# Altium project dashcam_cpu_v2.0.PrjPcb (part 13 of 13)
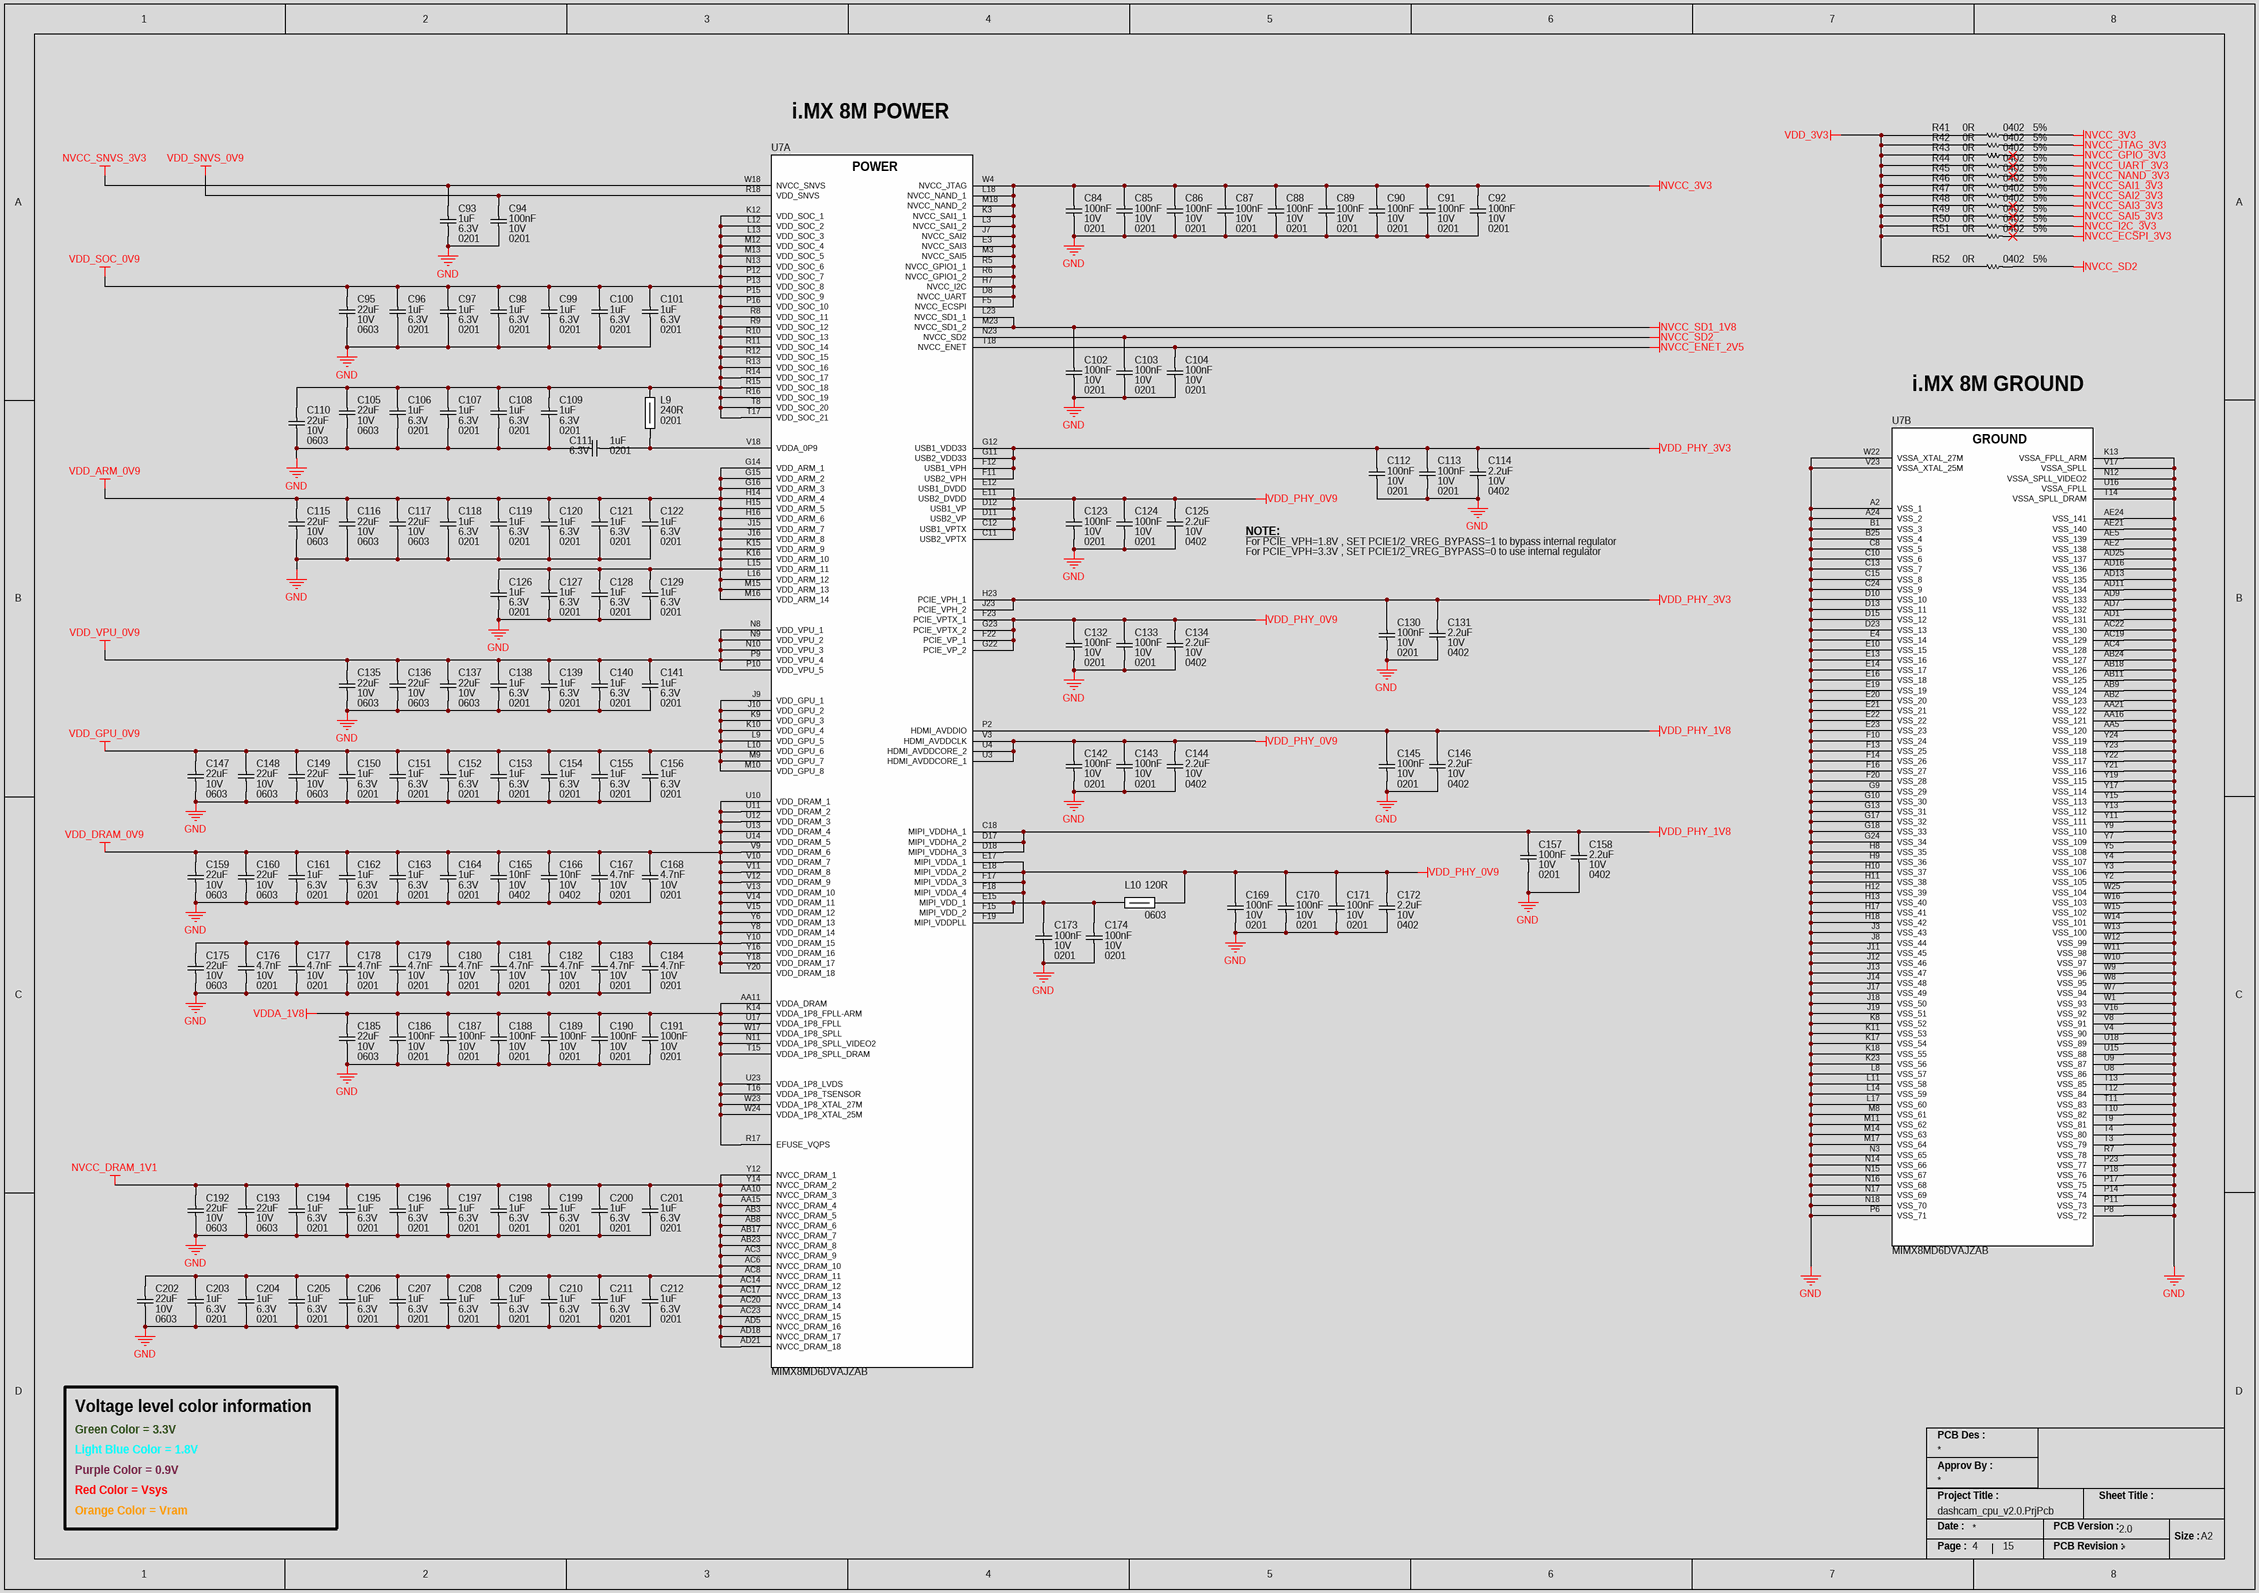
[diagram p116: mx8m_power.SchDoc]

## Nets that join several sheets
DC_IN: mx8m_pmic (D1.A J1.1), usb_debug (TP54.1)
GND: mx8m_dram (C213.1 R53.1 R54.1), mx8m_cfg (20 pins), mx8m_io (C221.1 C222.1 C223.1 U9.6), mx8m_phy (5 pins), mx8m_pmic (108 pins), dram_lpddr4 (84 pins), emmc_flash (21 pins), usb_debug (26 pins), wifi_ble (74 pins), boot_cfg (24 pins), mx8m_power (277 pins)
NVCC_3V3: mx8m_pmic (U6.55), mx8m_power (23 pins)
NVCC_DRAM_1V1: mx8m_pmic (8 pins), dram_lpddr4 (64 pins), mx8m_power (39 pins)
NVCC_JTAG_3V3: mx8m_cfg (D6.2 R55.2 R56.2 R57.2), boot_cfg (R158.2 R164.1 U15.5), mx8m_power (R42.2)
NVCC_SAI1_3V3: boot_cfg (16 pins), mx8m_power (R46.2)
NVCC_SAI2_3V3: mx8m_io (C222.2 U9.1 U9.12), mx8m_power (R47.2)
NVCC_SD1_1V8: mx8m_pmic (R37.2), emmc_flash (12 pins), mx8m_power (C102.2 U7.L23 U7.M23)
NVCC_SNVS_3V3: mx8m_cfg (6 pins), mx8m_pmic (5 pins), boot_cfg (5 pins), mx8m_power (C93.2 U7.W18)
VBUS_USB_DBG: mx8m_phy (R86.2), usb_debug (6 pins)
VDD_1V8: mx8m_pmic (8 pins), dram_lpddr4 (14 pins)
VDD_3V3: mx8m_io (10 pins), mx8m_pmic (C14.2 Q1.3 TP4.1), emmc_flash (7 pins), usb_debug (11 pins), wifi_ble (7 pins), mx8m_power (12 pins)
VDD_ARM_0V9: mx8m_pmic (9 pins), mx8m_power (26 pins)
VDD_DRAM_0V9: mx8m_pmic (7 pins), mx8m_power (38 pins)
VDD_GPU_0V9: mx8m_pmic (7 pins), mx8m_power (18 pins)
VDD_PHY_0V9: mx8m_pmic (C72.1 TP16.1 U6.18), mx8m_power (32 pins)
VDD_PHY_1V8: mx8m_pmic (C73.1 TP17.1 U6.26), mx8m_power (8 pins)
VDD_PHY_3V3: mx8m_pmic (C77.1 TP19.1 U6.39), mx8m_power (11 pins)
VDD_SNVS_0V9: mx8m_pmic (6 pins), mx8m_power (C94.2 U7.R18)
VDD_SOC_0V9: mx8m_pmic (7 pins), mx8m_power (35 pins)
VDD_VPU_0V9: mx8m_pmic (6 pins), mx8m_power (12 pins)
VDDA_1V8: mx8m_pmic (C75.1 R9.2 TP18.1 U6.28), mx8m_power (18 pins)
BOOT_MODE0: mx8m_cfg (U7.W6), usb_debug (TP52.1), boot_cfg (R161.1 R163.2 SW3.2 U15.3)
BOOT_MODE1: mx8m_cfg (U7.V6), usb_debug (TP53.1), boot_cfg (R157.1 R159.1 SW3.1 U15.6)
BT_PCM_CLK: mx8m_io (U9.9), wifi_ble (U13.9)
BT_PCM_IN: mx8m_io (U9.8), wifi_ble (U13.11)
BT_PCM_OUT: mx8m_io (U9.10), wifi_ble (U13.10)
BT_PCM_SYNC: mx8m_io (U9.7), wifi_ble (U13.7)
BT_UART_CTS_N: mx8m_io (U7.R24), wifi_ble (U13.47)
BT_UART_RTS_N: mx8m_io (U7.T24), wifi_ble (U13.48)
BT_UART_RXD: mx8m_io (U7.T25), wifi_ble (U13.46)
BT_UART_TXD: mx8m_io (U7.R25), wifi_ble (U13.49)
CONFIG_AUTO: mx8m_io (U7.D3), wifi_ble (U13.23)
CONFIG_HOST_0: mx8m_io (U7.G4), wifi_ble (U13.12)
CONFIG_HOST_1: mx8m_io (U7.H4), wifi_ble (U13.13)
DRAM_A_DATA0: mx8m_dram (U7.AE23), dram_lpddr4 (U10.AA11)
DRAM_A_DATA1: mx8m_dram (U7.AD24), dram_lpddr4 (U10.Y11)
DRAM_A_DATA2: mx8m_dram (U7.AE22), dram_lpddr4 (U10.V11)
DRAM_A_DATA3: mx8m_dram (U7.AD22), dram_lpddr4 (U10.U11)
DRAM_A_DATA4: mx8m_dram (U7.AA24), dram_lpddr4 (U10.U9)
DRAM_A_DATA5: mx8m_dram (U7.Y25), dram_lpddr4 (U10.V9)
DRAM_A_DATA6: mx8m_dram (U7.AA25), dram_lpddr4 (U10.Y9)
DRAM_A_DATA7: mx8m_dram (U7.AB25), dram_lpddr4 (U10.AA9)
DRAM_A_DATA8: mx8m_dram (U7.AB22), dram_lpddr4 (U10.AA2)
DRAM_A_DATA9: mx8m_dram (U7.AA22), dram_lpddr4 (U10.Y2)
DRAM_A_DATA10: mx8m_dram (U7.AA23), dram_lpddr4 (U10.V2)
DRAM_A_DATA11: mx8m_dram (U7.AA20), dram_lpddr4 (U10.U2)
DRAM_A_DATA12: mx8m_dram (U7.AA18), dram_lpddr4 (U10.U4)
DRAM_A_DATA13: mx8m_dram (U7.AB19), dram_lpddr4 (U10.V4)
DRAM_A_DATA14: mx8m_dram (U7.AA19), dram_lpddr4 (U10.Y4)
DRAM_A_DATA15: mx8m_dram (U7.AA17), dram_lpddr4 (U10.AA4)
DRAM_A_DMI0: mx8m_dram (U7.AD23), dram_lpddr4 (U10.Y10)
DRAM_A_DMI1: mx8m_dram (U7.AB20), dram_lpddr4 (U10.Y3)
DRAM_A_DQS0_N: mx8m_dram (U7.AC25), dram_lpddr4 (U10.V10)
DRAM_A_DQS0_P: mx8m_dram (U7.AC24), dram_lpddr4 (U10.W10)
DRAM_A_DQS1_N: mx8m_dram (U7.AC21), dram_lpddr4 (U10.V3)
DRAM_A_DQS1_P: mx8m_dram (U7.AB21), dram_lpddr4 (U10.W3)
DRAM_B_DATA0: mx8m_dram (U7.AE3), dram_lpddr4 (U10.B2)
DRAM_B_DATA1: mx8m_dram (U7.AD2), dram_lpddr4 (U10.C2)
DRAM_B_DATA2: mx8m_dram (U7.AE4), dram_lpddr4 (U10.E2)
DRAM_B_DATA3: mx8m_dram (U7.AD4), dram_lpddr4 (U10.F2)
DRAM_B_DATA4: mx8m_dram (U7.AA2), dram_lpddr4 (U10.F4)
DRAM_B_DATA5: mx8m_dram (U7.Y1), dram_lpddr4 (U10.E4)
DRAM_B_DATA6: mx8m_dram (U7.AA1), dram_lpddr4 (U10.C4)
DRAM_B_DATA7: mx8m_dram (U7.AB1), dram_lpddr4 (U10.B4)
DRAM_B_DATA8: mx8m_dram (U7.AB4), dram_lpddr4 (U10.B11)
DRAM_B_DATA9: mx8m_dram (U7.AA4), dram_lpddr4 (U10.C11)
DRAM_B_DATA10: mx8m_dram (U7.AA3), dram_lpddr4 (U10.E11)
DRAM_B_DATA11: mx8m_dram (U7.AA6), dram_lpddr4 (U10.F11)
DRAM_B_DATA12: mx8m_dram (U7.AA8), dram_lpddr4 (U10.F9)
DRAM_B_DATA13: mx8m_dram (U7.AB7), dram_lpddr4 (U10.E9)
DRAM_B_DATA14: mx8m_dram (U7.AA7), dram_lpddr4 (U10.C9)
DRAM_B_DATA15: mx8m_dram (U7.AA9), dram_lpddr4 (U10.B9)
DRAM_B_DMI0: mx8m_dram (U7.AD3), dram_lpddr4 (U10.C3)
DRAM_B_DMI1: mx8m_dram (U7.AB6), dram_lpddr4 (U10.C10)
DRAM_B_DQS0_N: mx8m_dram (U7.AC1), dram_lpddr4 (U10.E3)
DRAM_B_DQS0_P: mx8m_dram (U7.AC2), dram_lpddr4 (U10.D3)
DRAM_B_DQS1_N: mx8m_dram (U7.AC5), dram_lpddr4 (U10.E10)
DRAM_B_DQS1_P: mx8m_dram (U7.AB5), dram_lpddr4 (U10.D10)
DRAM_CA0_A: mx8m_dram (U7.AD17), dram_lpddr4 (U10.H2)
DRAM_CA0_B: mx8m_dram (U7.AE8), dram_lpddr4 (U10.R2)
DRAM_CA1_A: mx8m_dram (U7.AE16), dram_lpddr4 (U10.J2)
DRAM_CA1_B: mx8m_dram (U7.AE9), dram_lpddr4 (U10.P2)
DRAM_CA2_A: mx8m_dram (U7.AD20), dram_lpddr4 (U10.H9)
DRAM_CA2_B: mx8m_dram (U7.AC7), dram_lpddr4 (U10.R9)
DRAM_CA3_A: mx8m_dram (U7.AE20), dram_lpddr4 (U10.H10)
DRAM_CA3_B: mx8m_dram (U7.AE7), dram_lpddr4 (U10.R10)
DRAM_CA4_A: mx8m_dram (U7.AD19), dram_lpddr4 (U10.H11)
DRAM_CA4_B: mx8m_dram (U7.AE6), dram_lpddr4 (U10.R11)
DRAM_CA5_A: mx8m_dram (U7.AE19), dram_lpddr4 (U10.J11)
DRAM_CA5_B: mx8m_dram (U7.AD6), dram_lpddr4 (U10.P11)
DRAM_CK_A_N: mx8m_dram (U7.AE14), dram_lpddr4 (R93.2 R100.2 U10.J9)
DRAM_CK_A_P: mx8m_dram (U7.AD14), dram_lpddr4 (R94.2 R100.1 U10.J8)
DRAM_CK_B_N: mx8m_dram (U7.AE12), dram_lpddr4 (R96.2 R101.2 U10.P9)
DRAM_CK_B_P: mx8m_dram (U7.AD12), dram_lpddr4 (R97.2 R101.1 U10.P8)
DRAM_CKE0_A: mx8m_dram (U7.AC16), dram_lpddr4 (U10.J4)
DRAM_CKE0_B: mx8m_dram (U7.AD10), dram_lpddr4 (U10.P4)
DRAM_CKE1_A: mx8m_dram (U7.AE17), dram_lpddr4 (U10.J5)
DRAM_CKE1_B: mx8m_dram (U7.AE10), dram_lpddr4 (U10.P5)
DRAM_nCS0_A: mx8m_dram (U7.AE18), dram_lpddr4 (U10.H4)
DRAM_nCS0_B: mx8m_dram (U7.AC9), dram_lpddr4 (U10.R4)
DRAM_nCS1_A: mx8m_dram (U7.AC18), dram_lpddr4 (U10.H3)
DRAM_nCS1_B: mx8m_dram (U7.AD8), dram_lpddr4 (U10.R3)
DRAM_nRESET: mx8m_dram (R53.2 U7.AB13), dram_lpddr4 (U10.T11)
I2C1_SCL: mx8m_io (R83.1 U7.E7), mx8m_pmic (R34.2)
I2C1_SDA: mx8m_io (R82.1 U7.E8), mx8m_pmic (R33.2)
nWDOG: mx8m_io (U7.R4), mx8m_pmic (C25.1)
ONOFF: mx8m_cfg (R64.1 TP32.1 U7.W21), usb_debug (C268.1 S1.3), boot_cfg (D15.2)
PMIC_32K_OUT: mx8m_io (U7.F6), wifi_ble (U13.42)
PMIC_nINT: mx8m_io (U7.P4), mx8m_pmic (U6.1)
PMIC_ON_REQ: mx8m_cfg (U7.V20), mx8m_pmic (R26.1 R29.2)
PMIC_STBY_REQ: mx8m_cfg (U7.V21), mx8m_pmic (Q4.G R31.2)
POR_B: mx8m_cfg (D7.2 R59.1 TP31.1), mx8m_pmic (U6.3), usb_debug (D8.1)
PWM_LED: mx8m_io (U7.K6), mx8m_pmic (C37.2 Q3.G R27.2)
SAI1_RXD0: mx8m_io (U7.K2), boot_cfg (R136.1 R141.1)
SAI1_RXD1: mx8m_io (U7.L2), boot_cfg (R135.1 R142.1)
SAI1_RXD2: mx8m_io (U7.H2), boot_cfg (R134.1 R143.1)
SAI1_RXD3: mx8m_io (U7.J2), boot_cfg (R133.1 R144.1)
SAI1_RXD4: mx8m_io (U7.J1), boot_cfg (R132.1 R145.1)
SAI1_RXD5: mx8m_io (U7.F1), boot_cfg (R131.1 R146.1)
SAI1_RXD6: mx8m_io (U7.G2), boot_cfg (R130.1 R147.1)
SAI1_RXD7: mx8m_io (U7.G1), boot_cfg (R129.1 R148.1)
SAI1_TXD0: mx8m_io (U7.F2), boot_cfg (R128.1 R149.1)
SAI1_TXD1: mx8m_io (U7.E2), boot_cfg (R127.1 R150.1)
SAI1_TXD2: mx8m_io (U7.B2), boot_cfg (R140.1 R151.2 SW2.1)
SAI1_TXD3: mx8m_io (U7.D1), boot_cfg (R125.1 R152.1)
SAI1_TXD4: mx8m_io (U7.D2), boot_cfg (R139.1 R153.2 SW2.2)
SAI1_TXD5: mx8m_io (U7.C2), boot_cfg (R138.1 R154.2 SW2.3)
SAI1_TXD6: mx8m_io (U7.B3), boot_cfg (R137.1 R155.2 SW2.4)
SAI1_TXD7: mx8m_io (U7.C1), boot_cfg (R121.1 R156.1)
SD3_CLK: mx8m_io (U7.K22), emmc_flash (R105.2 TP40.1 U11.M6)
SD3_CMD: mx8m_io (U7.K21), emmc_flash (R103.1 TP39.1 U11.M5)
SD3_DATA0: mx8m_io (U7.L20), emmc_flash (R102.1 TP37.1 U11.A3)
SD3_DATA1: mx8m_io (U7.J22), emmc_flash (U11.A4)
SD3_DATA2: mx8m_io (U7.L19), emmc_flash (U11.A5)
SD3_DATA3: mx8m_io (U7.M19), emmc_flash (U11.B2)
SD3_DATA4: mx8m_io (U7.K19), emmc_flash (U11.B3)
SD3_DATA5: mx8m_io (U7.F21), emmc_flash (U11.B4)
SD3_DATA6: mx8m_io (U7.H20), emmc_flash (U11.B5)
SD3_DATA7: mx8m_io (U7.H21), emmc_flash (U11.B6)
SD3_RESET: mx8m_io (U7.K20), emmc_flash (R104.1 TP41.1 U11.K5)
SD3_STROBE: mx8m_io (U7.G21), emmc_flash (TP38.1 U11.H5)
SDIO_CLK: mx8m_io (U7.L25), wifi_ble (U13.59)
SDIO_CMD: mx8m_io (U7.L24), wifi_ble (U13.57)
SDIO_DATA_0: mx8m_io (U7.M25), wifi_ble (U13.56)
SDIO_DATA_1: mx8m_io (U7.M24), wifi_ble (U13.55)
SDIO_DATA_2: mx8m_io (U7.N25), wifi_ble (U13.53)
SDIO_DATA_3: mx8m_io (U7.P25), wifi_ble (U13.54)
SLP_CLK_IN: mx8m_io (U7.F3), wifi_ble (U13.61)
SYS_nRST: mx8m_pmic (R13.1), usb_debug (C269.1 S2.1)
UART1_RXD: mx8m_io (U7.C7), usb_debug (R112.2 TP45.1)
UART1_TXD: mx8m_io (U7.A7), usb_debug (R113.2 TP44.1)
UART2_RXD: mx8m_io (U7.B6), usb_debug (R110.2 TP48.1)
UART2_TXD: mx8m_io (U7.D6), usb_debug (R111.2 TP47.1)
USB1_D_N: mx8m_phy (R88.2), usb_debug (TP50.1)
USB1_D_P: mx8m_phy (R89.2), usb_debug (TP49.1)
WAKEUP_BT: mx8m_io (U7.J5), wifi_ble (U13.41)
WAKEUP_BT_HOST: mx8m_io (U7.H3), wifi_ble (U13.30)
WAKEUP_WLAN: mx8m_io (U7.C3), wifi_ble (U13.40)
WAKEUP_WLAN_HOST: mx8m_io (U7.F4), wifi_ble (U13.27)

## Assembly variants
Base Variant: all parts fitted